# EAGLE design ghost (EAGLE 8.6.0)
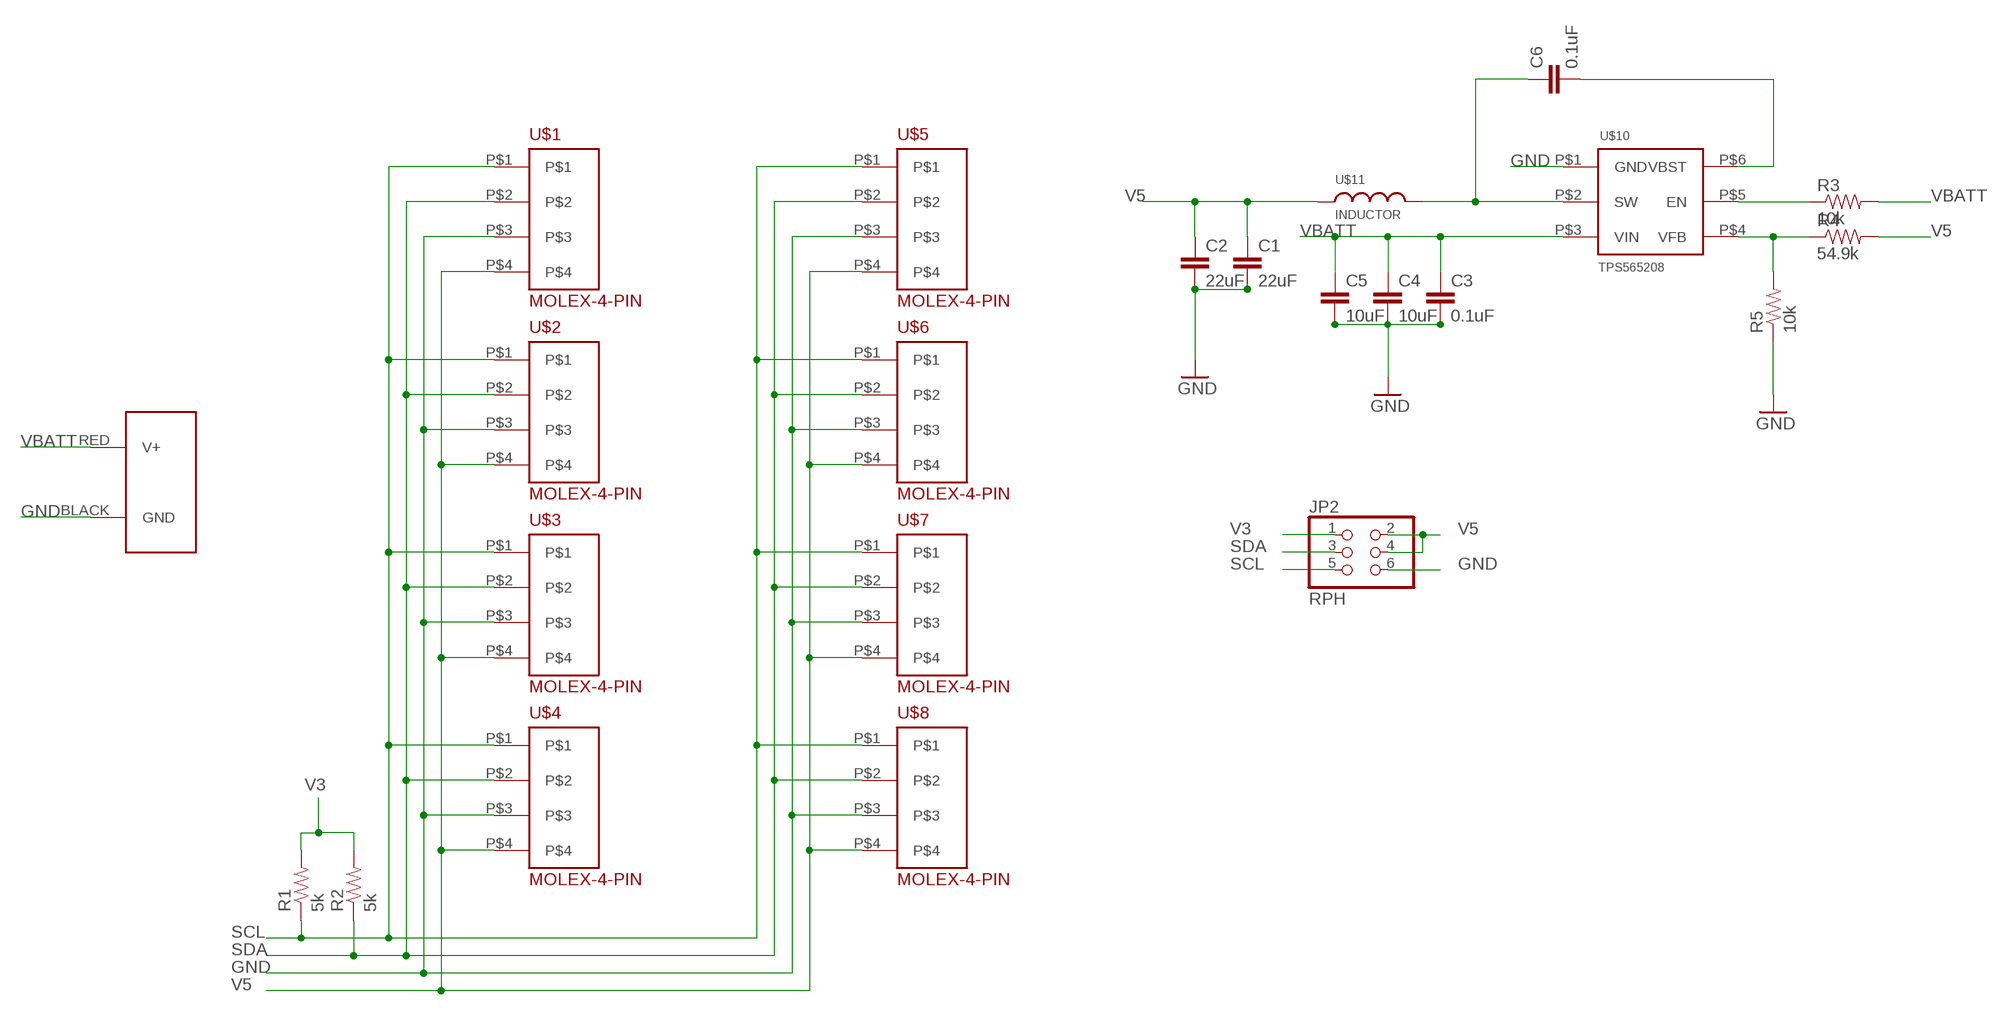
[diagram p0: schematic, sheet 1]

## Parts
C1  22uF  CAP0805  [0805]
C2  22uF  CAP0805  [0805]
C3  0.1uF  CAP0805  [0805]
C4  10uF  CAP0805  [0805]
C5  10uF  CAP0805  [0805]
C6  0.1uF  CAP0805  [0805]
J1  POWERPOLE_POWER45A_HORIZONTAL_DRILL  [POWERPOLE_PAIR_45A_HORIZ_HOLE]
JP2  RPH  PINHD-2X3/OCT  [2X03]
R1  5k  RESISTOR  [0805]
R2  5k  RESISTOR  [0805]
R3  10k  RESISTOR  [0805]
R4  54.9k  RESISTOR  [0805]
R5  10k  RESISTOR  [0805]
U$1  MOLEX-4-PIN  [MOLEX-4-PIN]
U$2  MOLEX-4-PIN  [MOLEX-4-PIN]
U$3  MOLEX-4-PIN  [MOLEX-4-PIN]
U$4  MOLEX-4-PIN  [MOLEX-4-PIN]
U$5  MOLEX-4-PIN  [MOLEX-4-PIN]
U$6  MOLEX-4-PIN  [MOLEX-4-PIN]
U$7  MOLEX-4-PIN  [MOLEX-4-PIN]
U$8  MOLEX-4-PIN  [MOLEX-4-PIN]
U$10  TPS565208  [SOT-23-THIN-6]
U$11  INDUCTOR  [0805]

## Nets
GND: C1.2 C2.2 C3.2 C4.2 C5.2 J1.BLACK(GND) JP2.6 R5.1 U$1.P$3 U$2.P$3 U$3.P$3 U$4.P$3 U$5.P$3 U$6.P$3 U$7.P$3 U$8.P$3 U$10.P$1(GND)
N$1: C6.1 U$10.P$2(SW) U$11.P$2
N$2: R3.1 U$10.P$5(EN)
N$3: C6.2 U$10.P$6(VBST)
N$4: R4.1 R5.2 U$10.P$4(VFB)
SCL: JP2.5 R1.1 U$1.P$1 U$2.P$1 U$3.P$1 U$4.P$1 U$5.P$1 U$6.P$1 U$7.P$1 U$8.P$1
SDA: JP2.3 R2.1 U$1.P$2 U$2.P$2 U$3.P$2 U$4.P$2 U$5.P$2 U$6.P$2 U$7.P$2 U$8.P$2
V3: JP2.1 R1.2 R2.2
V5: C1.1 C2.1 JP2.2 JP2.4 R4.2 U$1.P$4 U$2.P$4 U$3.P$4 U$4.P$4 U$5.P$4 U$6.P$4 U$7.P$4 U$8.P$4 U$11.P$1
VBATT: C3.1 C4.1 C5.1 J1.RED(V+) R3.2 U$10.P$3(VIN)

## Library data of the parts
C1-C6 = SparkFun:CAP: Capacitor Standard 0603 ceramic capacitor, and 0.1" leaded capacitor.
J1 = powerpoles:POWERPOLE_POWER: Anderson Powerpole Power Connector using ameteur radio standard layout
JP2 = pinhead_v2:PINHD-2X3: PIN HEADER
R1-R5 = SparkFun:RESISTOR: Resistor Basic schematic elements and footprints for 0603, 1206, and PTH 1/10th watt (small) resistors.
U$1-U$8 = GARTH:MOLEX-4-PIN
U$10 = GARTH:TPS565208
U$11 = GARTH:INDUCTOR

## Board
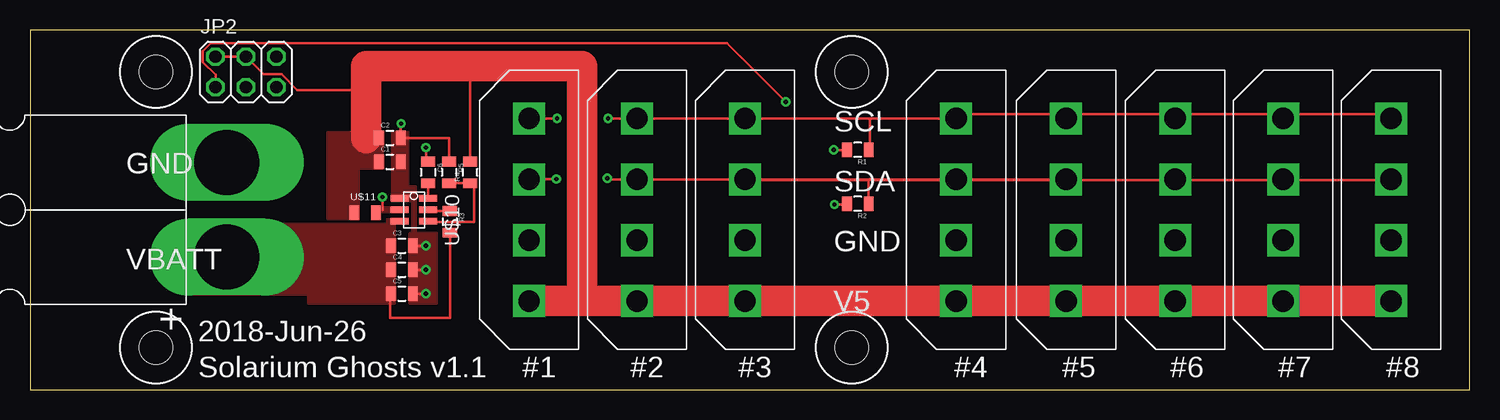
[diagram p1: board, top side]
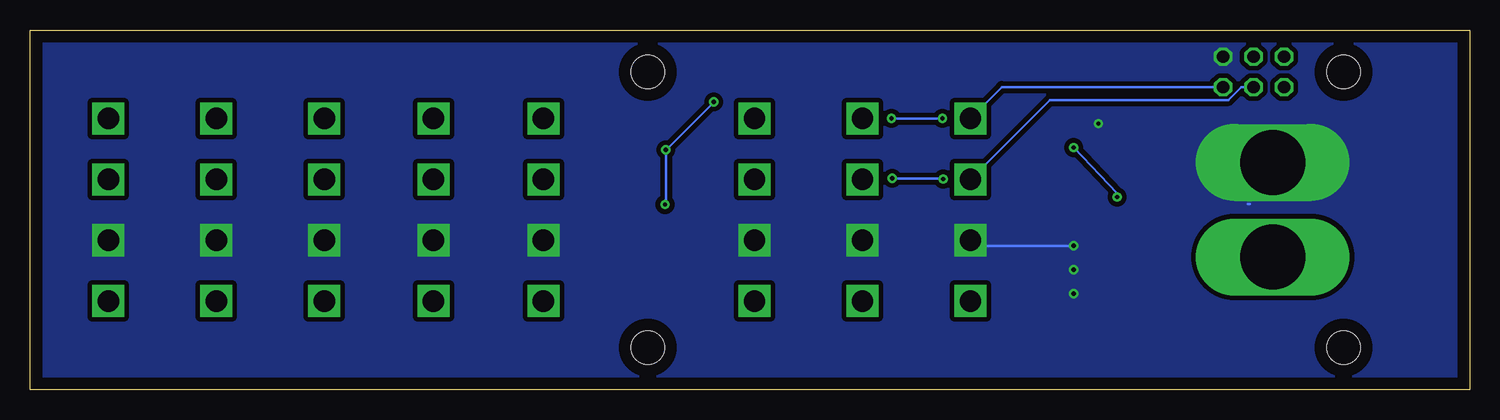
[diagram p2: board, bottom side, seen from below]

Size 120 x 30 mm. Coordinates in mm from the lower left corner, seen from the top.
Outline: 0,0 120,0 120,30 0,30 0,0
Copper layers (1*16): Top 0.035mm / dielectric 1.5mm / Bottom 0.035mm
Design rules "default *": minimum track width 8mil, minimum drill 0.35mm, track to track 8mil, track to pad 8mil, pad to pad 8mil, via to via 8mil, smd to smd 8mil, copper to edge 40mil, drill to drill 8mil, minimum pad ring 10mil, minimum via ring 8mil, stop-mask expansion 4mil, vias tented up to drill 0mil, thermal gap 10mil
Holes 2.75 mm at 10.5,3.5 10.5,26.5 68.5,26.5 68.5,3.5

### Footprints (pad centres in the part's own frame; a part is rotated, then mirrored left to right if it is on the bottom)
0805 = smd 0.8 x 1.2: 1 -0.9,0; 2 0.9,0
POWERPOLE_PAIR_45A_HORIZ_HOLE = drill 5.4 long: BLACK 3.95,-3.4; RED -3.95,-3.4
2X03 = drill 1.016 octagon: 1 -2.54,-1.27; 2 -2.54,1.27; 3 0,-1.27; 4 0,1.27; 5 2.54,-1.27; 6 2.54,1.27
MOLEX-4-PIN = drill 1.78 square: P$1 -7.62,0; P$2 -2.54,0; P$3 2.54,0; P$4 7.62,0
SOT-23-THIN-6 = smd 0.533 x 1.473: P$1 -0.95,-1.187; P$2 0,-1.187; P$3 0.95,-1.187; P$4 0.95,1.187; P$5 0,1.187; P$6 -0.95,1.187
0805' = smd 0.8 x 1.2: P$1 -0.9,0; P$2 0.9,0

### Placement (x,y rotation side)
C1  30,19 0 top
C2  30,21 0 top
C3  31,12 0 top
C4  31,10 0 top
C5  31,8 0 top
C6  33.19,18.12 270 top
J1  13,15 90 top
JP2  18,26.5 0 top
R1  69,20 180 top
R2  69,15.5 180 top
R3  35,14 270 top
R4  36.69,18.12 90 top
R5  34.94,18.12 270 top
U$1  41.6,15 270 top
U$2  104.47,15 270 top
U$3  50.6,15 270 top
U$4  113.47,15 270 top
U$5  59.6,15 270 top
U$6  86.37,15 270 top
U$7  77.2,15 270 top
U$8  95.47,15 270 top
U$10  32,15 270 top
U$11  INDUCTOR  [0805']  27.94,14.75 0 top

### Tracks (layer width: path | path; a pad name or v marks a point on that pad's centre or on a via)
GND  (via drill 0.35)
  Top 0.203: 32.32,12 C3.2 v33,12 | C4.2 v33,10 | C5.2 v33,8 | R5.1 34.94,21 C2.2 30.9,22.15 v30.94,22.19
  Bottom 0.203: 18.5,15.5 18.32,15.46 | v33,12 41.14,12 U$1.P$3
  pour Bottom (isolate 0.4, no thermals): 1,29 1,1 119,1 119,29
  pour Top (no thermals): 31.62,13 31.62,7.19 33.88,7.19 33.88,13.06 31.69,13.06
  pour Top (no thermals): 30.19,15.75 30.19,21.44 30.25,21.5 31.5,21.5 31.5,16.94 32.06,16.94 32.06,15.75
  pour Top (no thermals): 30.31,15.75 31.88,15.75 31.88,13 31.62,13 31.62,11.5 32.06,11.5 32.12,11.56 32.12,16.94 30.38,16.94 30.31,16.94
N$1  (via drill 0.35)
  Top 0.203: C6.1 33,19.21 v33,20.19 | v29.38,16.06 29.38,15
  Bottom 0.203: v33,20.19 29.38,16.38 v29.38,16.06
  pour Top (no thermals): 31.44,15.19 28.56,15.19 28.56,14.25 29.19,14.25 29.19,14.81 31.44,14.81
N$2
  Top 0.203: R3.1 33.29,14.9 U$10.P$5
N$3
  Top 0.203: U$10.P$6 C6.2
N$4
  Top 0.203: R5.2 R4.1 37,16.91 37,14 33.24,14 U$10.P$4
SCL  (via drill 0.35)
  Top 0.203: U$4.P$1 113,23 104.5,23 U$2.P$1 104,23 95.5,23 U$8.P$1 95,23 86.5,23 U$6.P$1 86,23 77.5,23 U$7.P$1 70,22.62 | 59.5,23 U$5.P$1 | U$5.P$1 70,22.62 | R1.1 70,20.1 70,22.62 | U$5.P$1 U$3.P$1 v48.19,22.62 | v43.94,22.62 U$1.P$1
  Bottom 0.203: v48.19,22.62 v43.94,22.62 | U$1.P$1 38.99,25.23 JP2.5
SDA  (via drill 0.35)
  Top 0.203: U$4.P$2 113,17.5 104.5,17.5 U$2.P$2 104,17.5 95.5,17.5 U$8.P$2 95,17.5 86.5,17.5 U$6.P$2 | 70,17.54 69.9,17.44 R2.1 | U$5.P$2 U$3.P$2 48.21,17.54 v48.12,17.62 | v43.88,17.56 41.62,17.56 U$1.P$2
  Top 0.254: U$5.P$2 70,17.54 U$7.P$2 U$6.P$2
  Bottom 0.203: v48.12,17.62 43.94,17.62 v43.88,17.56 | JP2.3 19.03,25.23 20.1,24.16 34.98,24.16 U$1.P$2
V3  (via drill 0.35)
  Top 0.203: R1.2 v67,20 | v67.06,15.44 68.04,15.44 R2.2 | JP2.1 15.46,26.26 14.39,27.33 14.39,28.21 15.06,28.88 58.12,28.88 v63,24
  Bottom 0.203: v67.06,15.44 67,15.5 v67,20 v63,24
V5
  Top 0.203: 28,22 29,21 C2.1 29,21.1 29,22.94 | JP2.2 JP2.4 19.47,26.3 20.98,26.3 22.28,25 28,25 | 36.62,27 36.69,26.94 R4.2
  Top 2.54: U$4.P$4 U$2.P$4 U$8.P$4 U$6.P$4 U$7.P$4 U$5.P$4 U$3.P$4 46,7.38 | U$1.P$4 46,7.38 | 46,7.38 46,27 36.62,27 28,27 28,25 28,22 28,21
  pour Top (no thermals): 27.31,14.25 25.5,14.25 24.81,14.25 24.81,21.12 24.81,21.31 24.81,21.5 29.38,21.5 29.38,18.44 27.5,18.44 27.38,18.31 27.38,14.25
VBATT
  Top 0.203: R3.2 35,6 30,6 30,7.9 C5.1
  pour Top (no thermals): 31.44,14.19 29.75,14.19 29.75,13.81 19.25,13.81 19.19,7.94 23.19,7.94 23.19,7.19 30.38,7.19 30.38,13.88 31.44,13.88
  pour Top (no thermals): 19.75,7.94 13.31,7.94 13.44,13.62 13.44,13.81 19.75,13.81

### Text on the board
tPlace: SCL | GND | SDA | GND | VBATT | V5 | 2018-Jun-26 | Solarium Ghosts v1.1 | #1 | #2 | #3 | #4 | #5 | #6 | #7 | #8